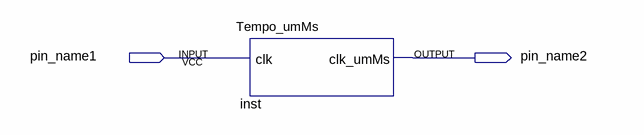
[diagram p0: schematic sheet]
// Quartus schematic Teste1ms.bdf as structural Verilog: 1 symbols, 2 pins
module Teste1ms (
  input  pin_name1,
  output pin_name2
);

  Tempo_umMs inst (.clk(pin_name1), .clk_umMs(pin_name2));
endmodule
